# EAGLE design Main Board (EAGLE 9.4.2)
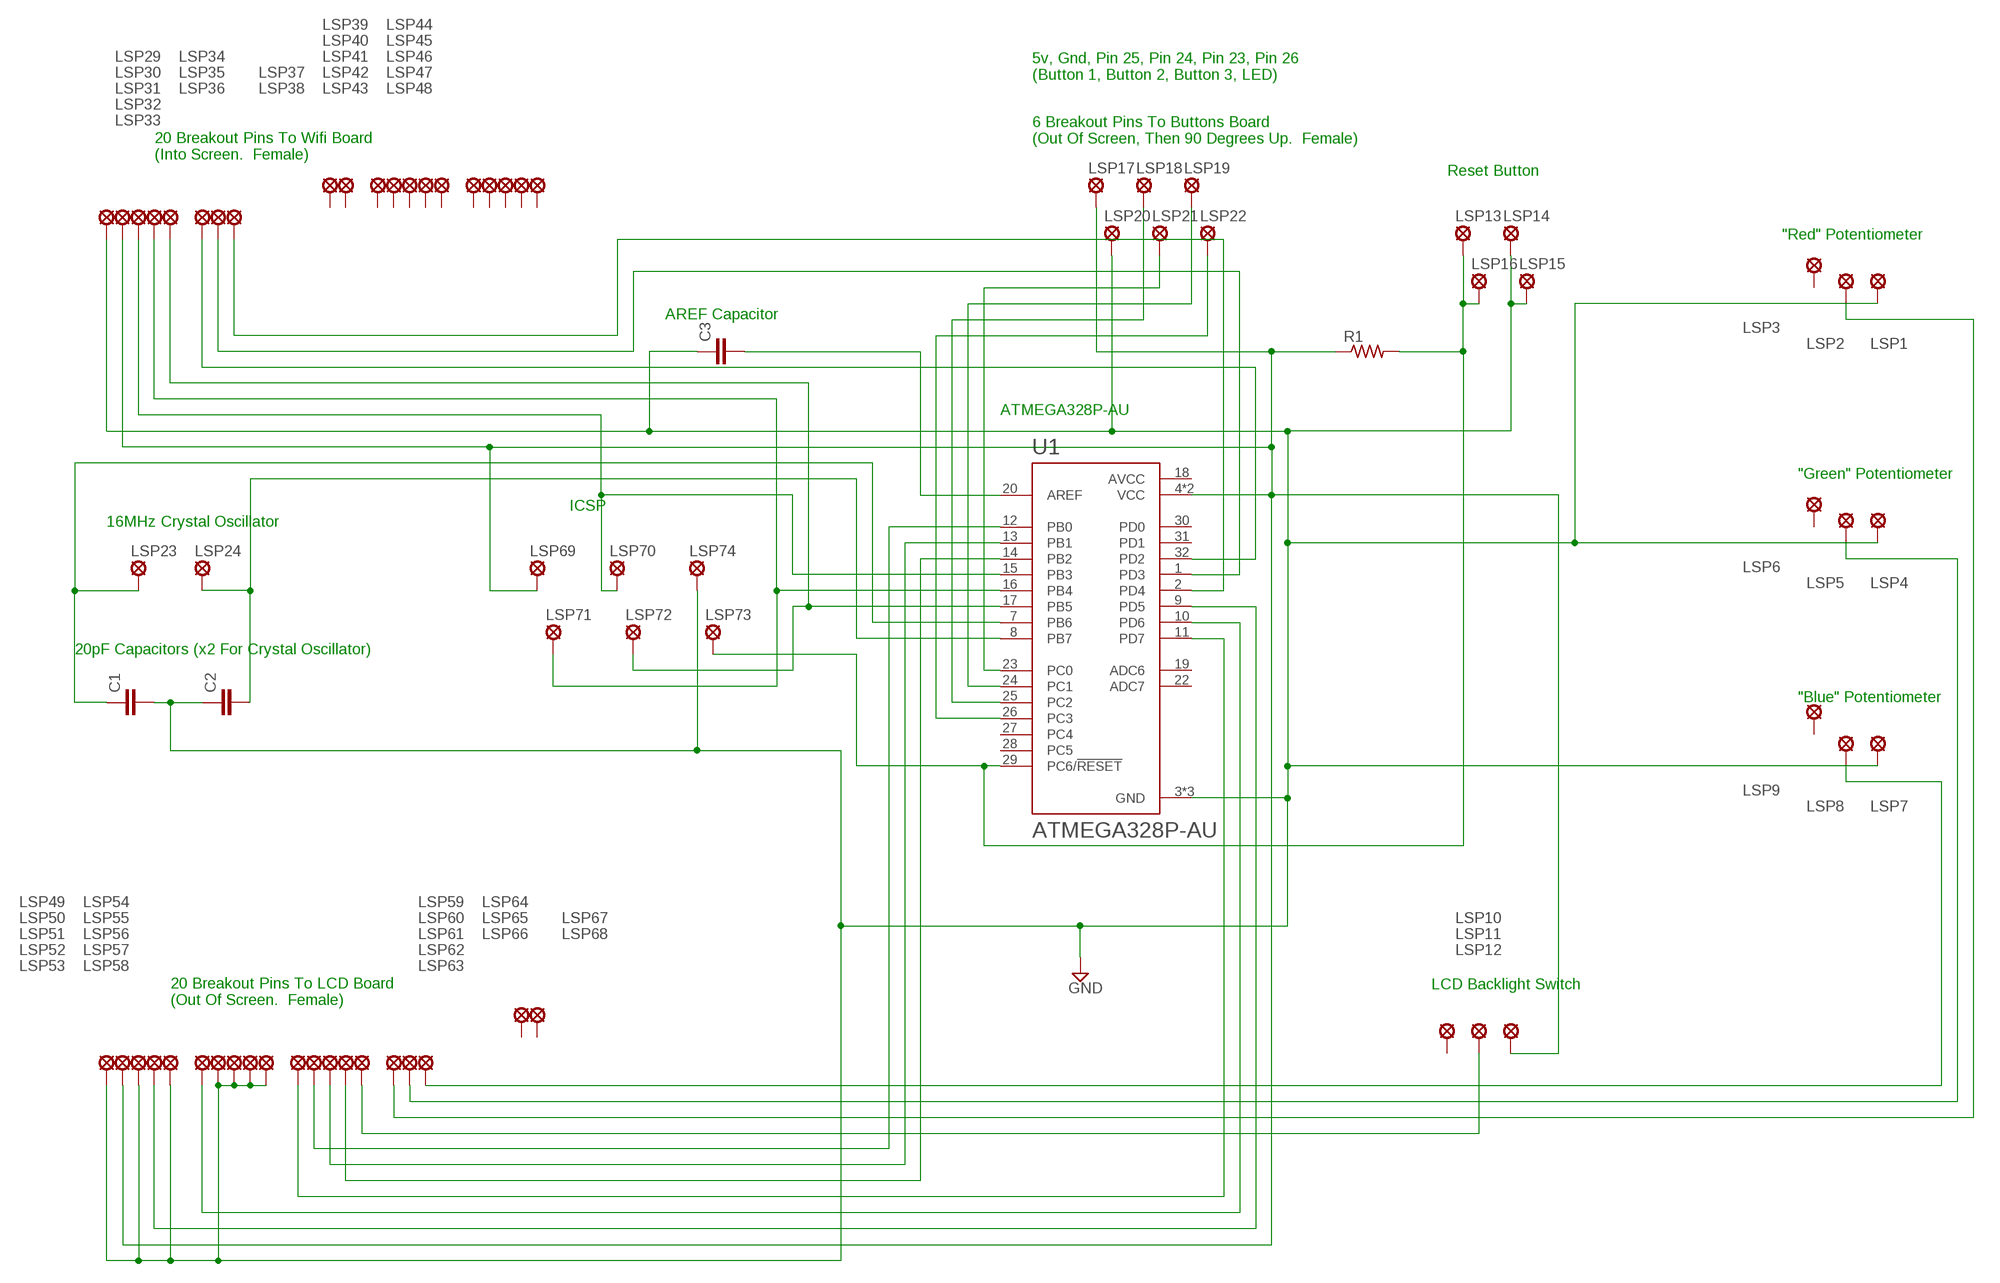
[diagram p0: schematic, sheet 1]

## Parts
C1  C5/2.5  [C5B2.5]
C2  C5/2.5  [C5B2.5]
C3  C5/2.5  [C5B2.5]
LSP1  LSP10_CLSP10_C  [LSP10_C]
LSP2  LSP10_CLSP10_C  [LSP10_C]
LSP3  LSP10_CLSP10_C  [LSP10_C]
LSP4  LSP10_CLSP10_C  [LSP10_C]
LSP5  LSP10_CLSP10_C  [LSP10_C]
LSP6  LSP10_CLSP10_C  [LSP10_C]
LSP7  LSP10_CLSP10_C  [LSP10_C]
LSP8  LSP10_CLSP10_C  [LSP10_C]
LSP9  LSP10_CLSP10_C  [LSP10_C]
LSP10  LSP10_CLSP10_C  [LSP10_C]
LSP11  LSP10_CLSP10_C  [LSP10_C]
LSP12  LSP10_CLSP10_C  [LSP10_C]
LSP13  LSP10_CLSP10_C  [LSP10_C]
LSP14  LSP10_CLSP10_C  [LSP10_C]
LSP15  LSP10_CLSP10_C  [LSP10_C]
LSP16  LSP10_CLSP10_C  [LSP10_C]
LSP17  LSP10_CLSP10_C  [LSP10_C]
LSP18  LSP10_CLSP10_C  [LSP10_C]
LSP19  LSP10_CLSP10_C  [LSP10_C]
LSP20  LSP10_CLSP10_C  [LSP10_C]
LSP21  LSP10_CLSP10_C  [LSP10_C]
LSP22  LSP10_CLSP10_C  [LSP10_C]
LSP23  LSP10_CLSP10_C  [LSP10_C]
LSP24  LSP10_CLSP10_C  [LSP10_C]
LSP29  LSP10_CLSP10_C  [LSP10_C]
LSP30  LSP10_CLSP10_C  [LSP10_C]
LSP31  LSP10_CLSP10_C  [LSP10_C]
LSP32  LSP10_CLSP10_C  [LSP10_C]
LSP33  LSP10_CLSP10_C  [LSP10_C]
LSP34  LSP10_CLSP10_C  [LSP10_C]
LSP35  LSP10_CLSP10_C  [LSP10_C]
LSP36  LSP10_CLSP10_C  [LSP10_C]
LSP37  LSP10_CLSP10_C  [LSP10_C]
LSP38  LSP10_CLSP10_C  [LSP10_C]
LSP39  LSP10_CLSP10_C  [LSP10_C]
LSP40  LSP10_CLSP10_C  [LSP10_C]
LSP41  LSP10_CLSP10_C  [LSP10_C]
LSP42  LSP10_CLSP10_C  [LSP10_C]
LSP43  LSP10_CLSP10_C  [LSP10_C]
LSP44  LSP10_CLSP10_C  [LSP10_C]
LSP45  LSP10_CLSP10_C  [LSP10_C]
LSP46  LSP10_CLSP10_C  [LSP10_C]
LSP47  LSP10_CLSP10_C  [LSP10_C]
LSP48  LSP10_CLSP10_C  [LSP10_C]
LSP49  LSP10_CLSP10_C  [LSP10_C]
LSP50  LSP10_CLSP10_C  [LSP10_C]
LSP51  LSP10_CLSP10_C  [LSP10_C]
LSP52  LSP10_CLSP10_C  [LSP10_C]
LSP53  LSP10_CLSP10_C  [LSP10_C]
LSP54  LSP10_CLSP10_C  [LSP10_C]
LSP55  LSP10_CLSP10_C  [LSP10_C]
LSP56  LSP10_CLSP10_C  [LSP10_C]
LSP57  LSP10_CLSP10_C  [LSP10_C]
LSP58  LSP10_CLSP10_C  [LSP10_C]
LSP59  LSP10_CLSP10_C  [LSP10_C]
LSP60  LSP10_CLSP10_C  [LSP10_C]
LSP61  LSP10_CLSP10_C  [LSP10_C]
LSP62  LSP10_CLSP10_C  [LSP10_C]
LSP63  LSP10_CLSP10_C  [LSP10_C]
LSP64  LSP10_CLSP10_C  [LSP10_C]
LSP65  LSP10_CLSP10_C  [LSP10_C]
LSP66  LSP10_CLSP10_C  [LSP10_C]
LSP67  LSP10_CLSP10_C  [LSP10_C]
LSP68  LSP10_CLSP10_C  [LSP10_C]
LSP69  LSP10_CLSP10_C  [LSP10_C]
LSP70  LSP10_CLSP10_C  [LSP10_C]
LSP71  LSP10_CLSP10_C  [LSP10_C]
LSP72  LSP10_CLSP10_C  [LSP10_C]
LSP73  LSP10_CLSP10_C  [LSP10_C]
LSP74  LSP10_CLSP10_C  [LSP10_C]
R1  R-US_VMTA55  [VMTA55]
U1  ATMEGA328P-AU  [QFP80P900X900X120-32N]

## Nets
GND: C1.2 C2.1 C3.1 LSP1.P$1(MP) LSP4.P$1(MP) LSP7.P$1(MP) LSP14.P$1(MP) LSP15.P$1(MP) LSP20.P$1(MP) LSP29.P$1(MP) LSP49.P$1(MP) LSP51.P$1(MP) LSP53.P$1(MP) LSP55.P$1(MP) LSP56.P$1(MP) LSP57.P$1(MP) LSP58.P$1(MP) LSP74.P$1(MP) U1.3(GND) U1.5(GND) U1.21(GND)
N$1: LSP2.P$1(MP) LSP64.P$1(MP)
N$2: LSP31.P$1(MP) LSP70.P$1(MP) U1.15(PB3)
N$3: LSP5.P$1(MP) LSP65.P$1(MP)
N$4: C1.1 LSP23.P$1(MP) U1.7(PB6)
N$5: C2.2 LSP24.P$1(MP) U1.8(PB7)
N$6: LSP8.P$1(MP) LSP66.P$1(MP)
N$7: LSP33.P$1(MP) LSP72.P$1(MP) U1.17(PB5)
N$8: LSP32.P$1(MP) LSP71.P$1(MP) U1.16(PB4)
N$9: LSP13.P$1(MP) LSP16.P$1(MP) LSP73.P$1(MP) R1.2 U1.29(PC6/!RESET)
N$10: LSP22.P$1(MP) U1.26(PC3)
N$11: LSP18.P$1(MP) U1.25(PC2)
N$12: LSP19.P$1(MP) U1.24(PC1)
N$13: LSP52.P$1(MP) U1.9(PD5)
N$14: LSP54.P$1(MP) U1.10(PD6)
N$16: LSP59.P$1(MP) U1.11(PD7)
N$17: LSP60.P$1(MP) U1.12(PB0)
N$18: LSP61.P$1(MP) U1.13(PB1)
N$19: LSP62.P$1(MP) U1.14(PB2)
N$20: LSP11.P$1(MP) LSP63.P$1(MP)
N$21: LSP12.P$1(MP) LSP17.P$1(MP) LSP30.P$1(MP) LSP50.P$1(MP) LSP69.P$1(MP) R1.1 U1.4(VCC) U1.6(VCC)
N$22: LSP21.P$1(MP) U1.23(PC0)
N$23: C3.2 U1.20(AREF)
N$26: LSP34.P$1(MP) U1.32(PD2)
N$27: LSP35.P$1(MP) U1.1(PD3)
N$28: LSP36.P$1(MP) U1.2(PD4)
Unconnected: LSP3.P$1(MP) LSP6.P$1(MP) LSP9.P$1(MP) LSP10.P$1(MP) LSP37.P$1(MP) LSP38.P$1(MP) LSP39.P$1(MP) LSP40.P$1(MP) LSP41.P$1(MP) LSP42.P$1(MP) LSP43.P$1(MP) LSP44.P$1(MP) LSP45.P$1(MP) LSP46.P$1(MP) LSP47.P$1(MP) LSP48.P$1(MP) LSP67.P$1(MP) LSP68.P$1(MP) U1.19(ADC6) U1.22(ADC7) U1.27(PC4) U1.28(PC5) U1.30(PD0) U1.31(PD1)

## Notes on the sheet
- 5v, Gnd, Pin 25, Pin 24, Pin 23, Pin 26
  (Button 1, Button 2, Button 3, LED)
- 6 Breakout Pins To Buttons Board
  (Out Of Screen, Then 90 Degrees Up.  Female)
- 20 Breakout Pins To Wifi Board
  (Into Screen.  Female)
- Reset Button
- "Red" Potentiometer
- AREF Capacitor
- ATMEGA328P-AU
- "Green" Potentiometer
- ICSP
- 16MHz Crystal Oscillator
- 20pF Capacitors (x2 For Crystal Oscillator)
- "Blue" Potentiometer
- LCD Backlight Switch
- 20 Breakout Pins To LCD Board
  (Out Of Screen.  Female)

## Power pins joined to a net without a drawn wire
AVCC: U1.18(AVCC)

## Library data of the parts
C1-C3 = capacitor-wima:C: CAPACITOR naming: grid - package width
LSP1-LSP24 LSP29-LSP74 = tbtaco-solpad:LSP10_C: SOLDER PAD drill 1.0 mm, distributor Buerklin, 12H555
R1 = rcl:R-US_: RESISTOR, American symbol; SPICEPREFIX: R
U1 = ATMEGA328P-AU:ATMEGA328P-AU: ATmega Series 20 MHz 32 KB Flash 2 KB SRAM 8-Bit Microcontroller - TQFP-32; AVAILABILITY: Unavailable; DESCRIPTION: Microcontroller Mcu, 8 Bit, Atmega, 20mhz, Tqfp-32; MF: Microchip; MP: ATMEGA328P-AU; PACKAGE: TQFP-32 Microchip; PRICE: None

## Board
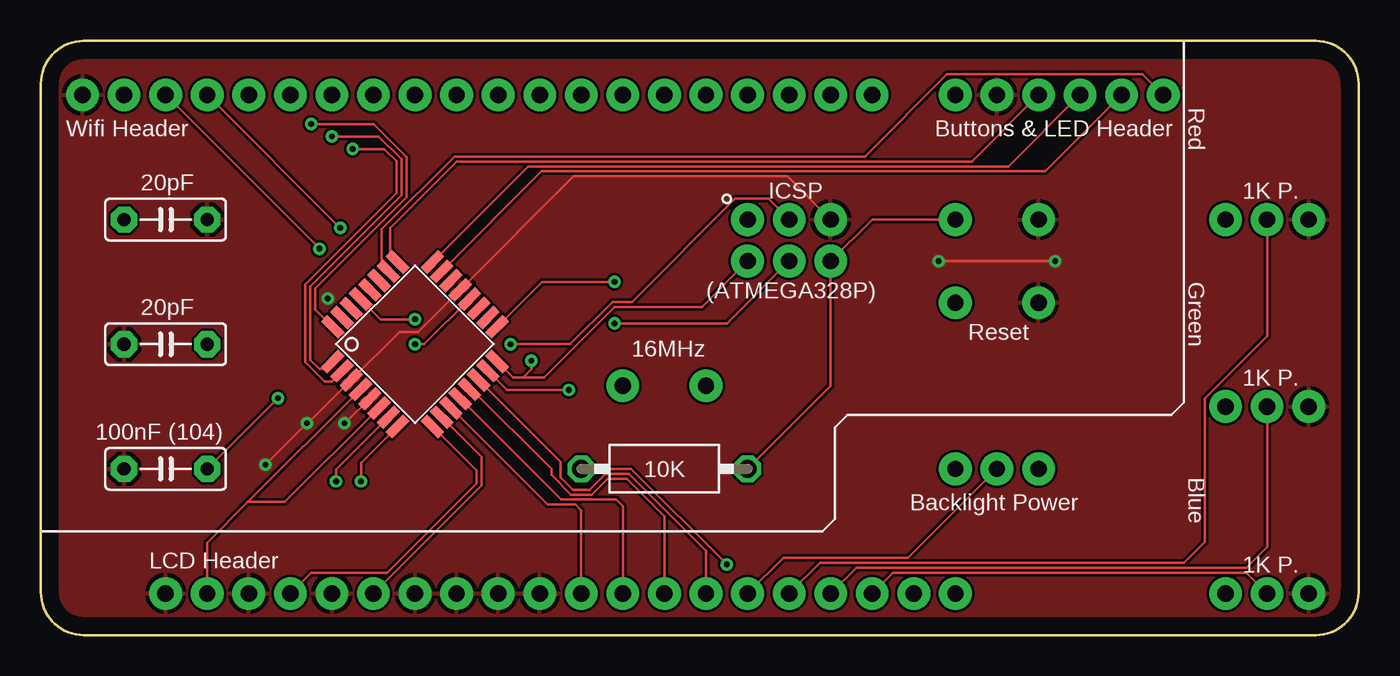
[diagram p1: board, top side]
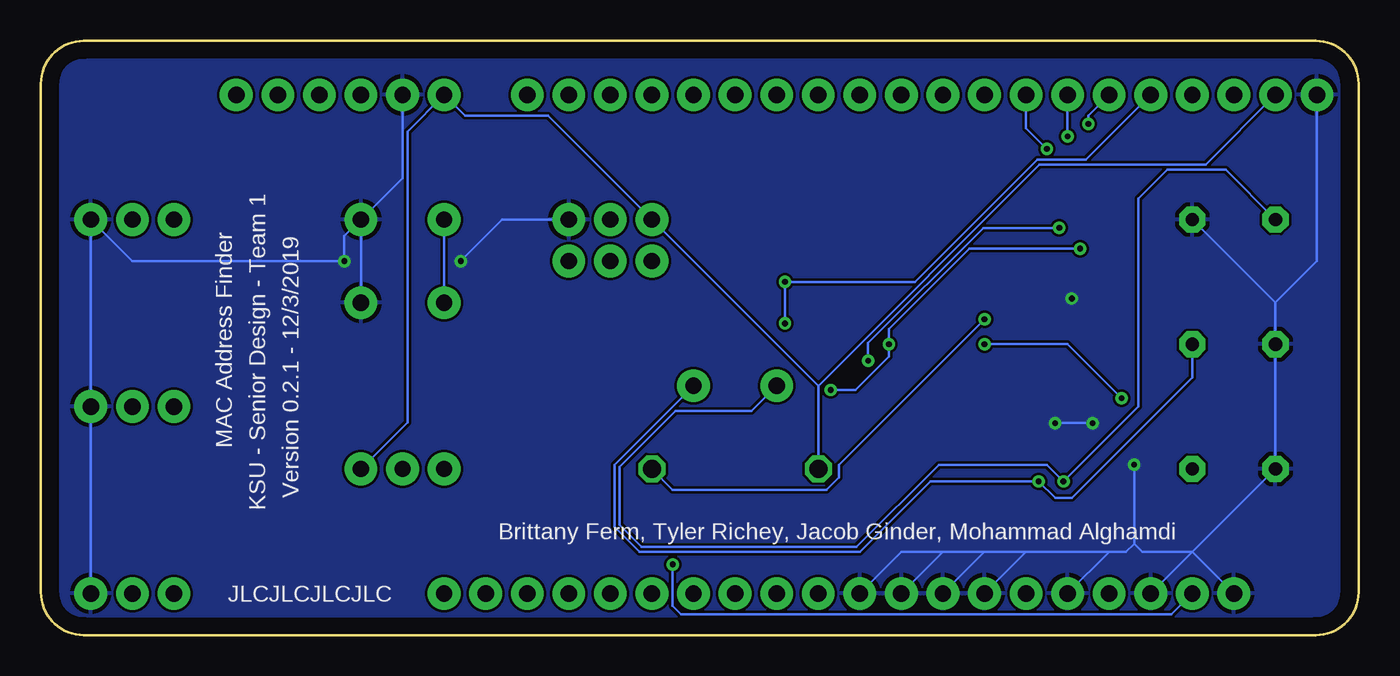
[diagram p2: board, bottom side, seen from below]

Size 80.52 x 36.32 mm. Coordinates in mm from the lower left corner, seen from the top.
Outline: 2.6,36.32 77.92,36.32 arc-90 80.52,33.72 80.52,2.6 arc-90 77.92,0 2.6,0 arc-90 0,2.6 0,33.72 arc-90 2.6,36.32
Copper layers (1*16): Top 0.035mm / dielectric 1.5mm / Bottom 0.035mm
Design rules "default": minimum track width 6mil, minimum drill 0.35mm, track to track 6mil, track to pad 6mil, pad to pad 6mil, via to via 6mil, smd to smd 6mil, copper to edge 40mil, drill to drill 6mil, minimum pad ring 10mil, minimum via ring 8mil, stop-mask expansion 4mil, vias tented up to drill 0mil, thermal gap 10mil

### Footprints (pad centres in the part's own frame; a part is rotated, then mirrored left to right if it is on the bottom)
C5B2.5 = drill 0.813 pad 1.6 octagon: 1 -2.54,0; 2 2.54,0
LSP10_C = drill 1 pad 2: P$1 0,0
VMTA55 = drill 1.1 octagon: 1 -5.08,0; 2 5.08,0
QFP80P900X900X120-32N = smd 1.5 x 0.55: 1 -4.3,2.8; 2 -4.3,2; 3 -4.3,1.2; 4 -4.3,0.4; 5 -4.3,-0.4; 6 -4.3,-1.2; 7 -4.3,-2; 8 -4.3,-2.8; 17 4.3,-2.8; 18 4.3,-2; 19 4.3,-1.2; 20 4.3,-0.4; 21 4.3,0.4; 22 4.3,1.2; 23 4.3,2; 24 4.3,2.8 | smd 0.55 x 1.5: 9 -2.8,-4.3; 10 -2,-4.3; 11 -1.2,-4.3; 12 -0.4,-4.3; 13 0.4,-4.3; 14 1.2,-4.3; 15 2,-4.3; 16 2.8,-4.3; 25 2.8,4.3; 26 2,4.3; 27 1.2,4.3; 28 0.4,4.3; 29 -0.4,4.3; 30 -1.2,4.3; 31 -2,4.3; 32 -2.8,4.3

### Placement (x,y rotation side)
C1  7.62,25.4 0 top
C2  7.62,17.78 0 top
C3  7.62,10.16 0 top
LSP1  77.47,25.4 0 top
LSP2  74.93,25.4 0 top
LSP3  72.39,25.4 0 top
LSP4  77.47,13.97 0 top
LSP5  74.93,13.97 0 top
LSP6  72.39,13.97 0 top
LSP7  77.47,2.54 0 top
LSP8  74.93,2.54 0 top
LSP9  72.39,2.54 0 top
LSP10  55.88,10.16 0 top
LSP11  58.42,10.16 0 top
LSP12  60.96,10.16 0 top
LSP13  55.88,25.4 0 top
LSP14  60.96,25.4 0 top
LSP15  60.96,20.32 0 top
LSP16  55.88,20.32 0 top
LSP17  55.88,33.02 0 top
LSP18  60.96,33.02 0 top
LSP19  63.5,33.02 0 top
LSP20  58.42,33.02 0 top
LSP21  66.04,33.02 0 top
LSP22  68.58,33.02 0 top
LSP23  35.56,15.24 0 top
LSP24  40.64,15.24 0 top
LSP29  2.54,33.02 0 top
LSP30  5.08,33.02 0 top
LSP31  7.62,33.02 0 top
LSP32  10.16,33.02 0 top
LSP33  12.7,33.02 0 top
LSP34  15.24,33.02 0 top
LSP35  17.78,33.02 0 top
LSP36  20.32,33.02 0 top
LSP37  22.86,33.02 0 top
LSP38  25.4,33.02 0 top
LSP39  27.94,33.02 0 top
LSP40  30.48,33.02 0 top
LSP41  33.02,33.02 0 top
LSP42  35.56,33.02 0 top
LSP43  38.1,33.02 0 top
LSP44  40.64,33.02 0 top
LSP45  43.18,33.02 0 top
LSP46  45.72,33.02 0 top
LSP47  48.26,33.02 0 top
LSP48  50.8,33.02 0 top
LSP49  7.62,2.54 0 top
LSP50  10.16,2.54 0 top
LSP51  12.7,2.54 0 top
LSP52  15.24,2.54 0 top
LSP53  17.78,2.54 0 top
LSP54  20.32,2.54 0 top
LSP55  22.86,2.54 0 top
LSP56  25.4,2.54 0 top
LSP57  27.94,2.54 0 top
LSP58  30.48,2.54 0 top
LSP59  33.02,2.54 0 top
LSP60  35.56,2.54 0 top
LSP61  38.1,2.54 0 top
LSP62  40.64,2.54 0 top
LSP63  43.18,2.54 0 top
LSP64  45.72,2.54 0 top
LSP65  48.26,2.54 0 top
LSP66  50.8,2.54 0 top
LSP67  53.34,2.54 0 top
LSP68  55.88,2.54 0 top
LSP69  43.18,25.4 0 top
LSP70  45.72,25.4 0 top
LSP71  43.18,22.86 0 top
LSP72  45.72,22.86 0 top
LSP73  48.26,22.86 0 top
LSP74  48.26,25.4 0 top
R1  38.1,10.16 0 top
U1  22.86,17.78 45 top

### Tracks (layer width: path | path; a pad name or v marks a point on that pad's centre or on a via)
GND  (via drill 0.35)
  Top 0.152: v54.86,22.86 v61.98,22.86 | LSP74.P$1 45.62,28.04 32.56,28.04 U1.21 23.06,18.54 21.93,18.54 U1.3 16.34,12.95 v16.26,12.95 v13.72,10.41 | U1.5 18.6,12.95 v18.54,12.95
  Bottom 0.152: LSP7.P$1 LSP4.P$1 LSP1.P$1 74.93,22.86 v61.98,22.86 61.98,24.38 LSP14.P$1 | LSP15.P$1 LSP14.P$1 | LSP14.P$1 58.42,27.94 LSP20.P$1 | 5.08,20.32 C2.1 C3.1 10.16,5.08 | C1.2 5.08,20.32 | LSP51.P$1 10.16,5.08 | LSP53.P$1 15.24,5.08 | 10.16,5.08 13.21,5.08 13.72,5.59 | LSP55.P$1 20.32,5.08 | LSP56.P$1 22.86,5.08 | LSP57.P$1 25.4,5.08 | LSP58.P$1 27.94,5.08 25.4,5.08 | 25.4,5.08 22.86,5.08 | 22.86,5.08 20.32,5.08 | 20.32,5.08 14.22,5.08 13.72,5.59 | LSP29.P$1 2.54,22.86 5.08,20.32 | v54.86,22.86 52.32,25.4 LSP74.P$1 | v18.54,12.95 v16.26,12.95 | v13.72,10.41 13.72,5.59 | LSP49.P$1 10.16,5.08
  other vias: 17.53,20.57
  pour Top: 0,36.32 80.52,36.32 80.52,0 0,0
  pour Bottom: 0,36.32 80.52,36.32 80.52,0 0,0
N$1
  Top 0.152: LSP64.P$1 47.6,4.42 69.85,4.42 71.12,5.69 71.12,14.48 74.93,18.29 LSP2.P$1
N$2  (via drill 0.35)
  Top 0.152: LSP31.P$1 v17.02,23.62 | v28.7,17.78 32.34,17.78 34.93,20.37 36.12,20.37 42.42,26.67 44.45,26.67 LSP70.P$1 | U1.15 28.48,14.99 v32.26,14.99
  Bottom 0.152: v17.02,23.62 23.78,23.62 28.7,18.7 v28.7,17.78 28.7,17.02 30.73,14.99 v32.26,14.99
N$3
  Top 0.152: LSP65.P$1 49.84,4.12 67.06,4.12 67.18,4.12 73.66,4.12 74.93,5.38 LSP5.P$1
N$4  (via drill 0.35)
  Top 0.152: U1.7 18.03,10.13 v18.03,9.4
  Bottom 0.152: C1.1 8.13,28.45 11.68,28.45 13.46,26.67 13.46,13.97 v18.03,9.4 19.05,10.41 25.65,10.41 30.68,5.38 43.82,5.38 45.16,6.73 45.16,10.29 41.73,13.72 37.08,13.72 LSP23.P$1
N$5  (via drill 0.35)
  Top 0.152: U1.8 19.56,10.52 v19.56,9.4
  Bottom 0.152: C2.2 10.16,15.75 17.53,8.38 18.54,8.38 v19.56,9.4 26.16,9.4 30.48,5.08 43.94,5.08 45.47,6.6 45.47,10.41 LSP24.P$1
N$6
  Top 0.152: LSP8.P$1 73.66,3.81 52.07,3.81 LSP66.P$1
N$7  (via drill 0.35)
  Top 0.152: U1.17 30.63,21.59 v35.05,21.59 | LSP72.P$1 41.91,19.05 v35.05,19.05
  Bottom 0.152: v35.05,19.05 v35.05,21.59 27.1,21.59 19.63,29.06 16.66,29.06 LSP33.P$1
N$8  (via drill 0.35)
  Top 0.152: U1.16 28.85,15.75 29.46,15.75 | 29.46,15.75 30.73,15.75 35.05,20.07 40.39,20.07 LSP71.P$1 | LSP32.P$1 v18.29,24.89 | v29.97,16.76 29.97,16.26 29.46,15.75
  Bottom 0.152: v18.29,24.89 22.94,24.89 29.97,17.86 v29.97,16.76
N$9  (via drill 0.35)
  Top 0.152: R1.2 48.26,15.24 LSP73.P$1 50.8,25.4 LSP13.P$1 | U1.29 20.77,19.3 v22.86,19.3
  Bottom 0.152: LSP13.P$1 LSP16.P$1 | v22.86,19.3 31.75,10.41 31.75,9.65 32.51,8.89 41.91,8.89 R1.2
N$10
  Top 0.152: LSP22.P$1 67.31,34.29 55.37,34.29 50.34,29.26 25.27,29.26 20.83,24.82 20.83,22.61 21.2,22.23 U1.26
N$11
  Top 0.152: LSP18.P$1 56.9,28.96 25.4,28.96 21.34,24.89 21.34,23.11 21.65,22.8 U1.25
N$12
  Top 0.152: LSP19.P$1 59.13,28.65 29.77,28.65 U1.24
N$13
  Top 0.152: LSP52.P$1 16.51,3.81 21.16,3.81 26.62,9.27 26.62,10.06 U1.9
N$14
  Top 0.152: LSP54.P$1 26.92,9.14 26.92,10.89 U1.10
N$16
  Top 0.152: LSP59.P$1 33.02,7.62 32.66,7.98 30.97,7.98 U1.11
N$17
  Top 0.152: LSP60.P$1 35.56,7.87 35.15,8.28 31.79,8.28 U1.12
N$18
  Top 0.152: LSP61.P$1 38.1,7.27 35.81,9.55 34.62,9.55 33.65,8.59 32.39,8.59 31.19,9.78 31.19,10.16 26.33,15.02 U1.13
N$19
  Top 0.152: LSP62.P$1 40.64,5.16 35.94,9.86 34.49,9.86 33.53,8.89 32.51,8.89 31.75,9.65 31.75,10.59 U1.14
N$20
  Top 0.152: LSP63.P$1 45.36,4.72 52.98,4.72 LSP11.P$1
N$21  (via drill 0.35)
  Top 0.152: 12.64,8.13 10.16,5.65 LSP50.P$1 | 12.64,8.13 U1.4 | U1.6 14.9,8.13 12.64,8.13 | v41.91,4.32 36.07,10.16 R1.1
  Bottom 0.152: LSP12.P$1 58.12,13.01 58.12,30.79 LSP17.P$1 54.61,31.75 49.53,31.75 LSP69.P$1 33.02,15.24 | 33.02,15.24 R1.1 | LSP30.P$1 9.35,28.75 19.51,28.75 33.02,15.24 | LSP50.P$1 11.43,1.27 41.4,1.27 41.91,1.78 v41.91,4.32
N$22
  Top 0.152: LSP21.P$1 61.37,28.35 30.6,28.35 U1.23
N$23  (via drill 0.35)
  Top 0.152: U1.20 23.43,17.78 v22.86,17.78 | C3.2 v14.48,14.48
  Bottom 0.152: v14.48,14.48 17.78,17.78 v22.86,17.78
N$26  (via drill 0.35)
  Top 0.152: v16.51,31.24 20.32,31.24 22.35,29.21 22.35,26.77 16.76,21.18 16.76,19.92 U1.32
  Bottom 0.152: LSP34.P$1 16.51,31.75 v16.51,31.24
N$27  (via drill 0.35)
  Top 0.152: v17.78,30.48 20.65,30.48 22.05,29.08 22.05,26.9 16.46,21.31 16.46,16.82 17.02,16.26 17.53,16.26 17.84,16.57 U1.1
  Bottom 0.152: LSP35.P$1 v17.78,30.48
N$28  (via drill 0.35)
  Top 0.152: v19.05,29.72 20.98,29.72 21.74,28.96 21.74,27.02 16.15,21.43 16.15,16.69 17.35,15.49 17.78,15.49 18.41,16.12 U1.2
  Bottom 0.152: LSP36.P$1 20.32,30.99 v19.05,29.72

### Text on the board
tPlace: Red | Wifi Header | Buttons & LED Header | 20pF | ICSP | 1K P. | Green | (ATMEGA328P) | 20pF | Reset | 16MHz | 1K P. | 100nF (104) | 10K | Blue | Backlight Power | LCD Header | 1K P.
bPlace: MAC Address Finder | Version 0.2.1 - 12/3/2019 | KSU - Senior Design - Team 1 | Brittany Ferm, Tyler Richey, Jacob Ginder, Mohammad Alghamdi | JLCJLCJLCJLC